# Altium schematic sheet SCH_2-way_Traffic.SchDoc
size A
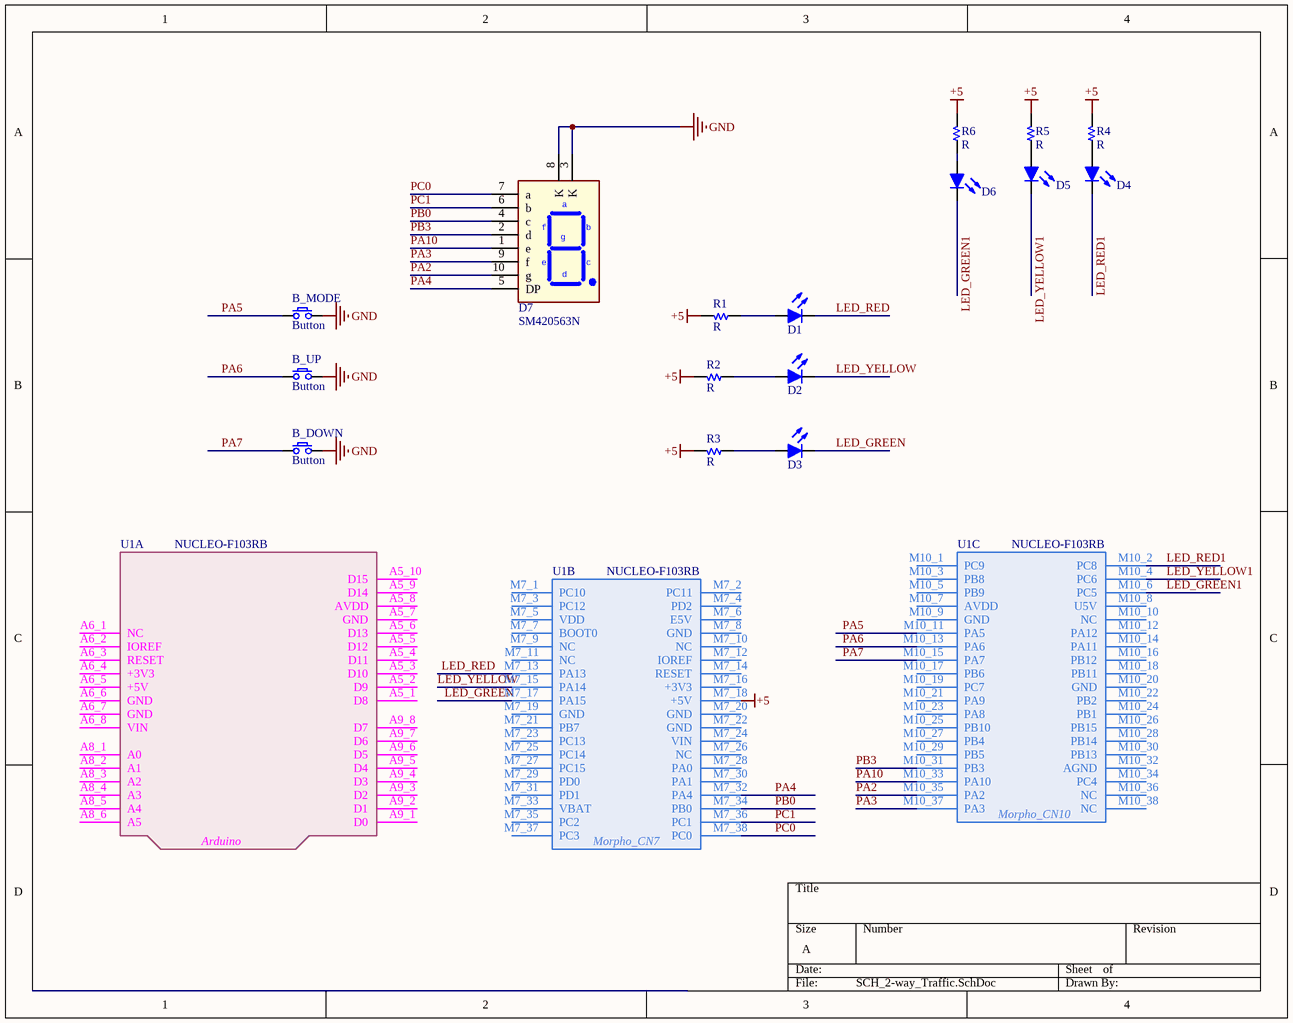
[diagram p0: SCH_2-way_Traffic.SchDoc]

## Parts
B_DOWN  Button  [SW/2/DIP]
B_MODE  Button  [SW/2/DIP]
B_UP  Button  [SW/2/DIP]
D1  Led  [LED 3MM - red]  (value not drawn)
D2  Led  [LED 3MM - yellow]  (value not drawn)
D3  Led  [LED 3MM - green]  (value not drawn)
D4  Led  [LED 3MM - red]  (value not drawn)
D5  Led  [LED 3MM - yellow]  (value not drawn)
D6  Led  [LED 3MM - green]  (value not drawn)
D7  SM420563N  [LED/7SEG/0.56]
R1  R  [R 0805]
R2  R  [R 0805]
R3  R  [R 0805]
R4  R  [R 0805]
R5  R  [R 0805]
R6  R  [R 0805]
U1  NUCLEO-F103RB  [NUCLEO]  (parts A,B,C of 3)

## Nets
+5: R1.2 R2.2 R3.2 R4.2 R5.2 R6.2 U1.M7_18(+5V)
GND: B_DOWN.2 B_MODE.2 B_UP.2 D7.3(K) D7.8(K)
LED_GREEN: D3.2(K) U1.M7_17(PA15)
LED_GREEN1: D6.2(K) U1.M10_6(PC5)
LED_RED: D1.2(K) U1.M7_13(PA13)
LED_RED1: D4.2(K) U1.M10_2(PC8)
LED_YELLOW: D2.2(K) U1.M7_15(PA14)
LED_YELLOW1: D5.2(K) U1.M10_4(PC6)
PA2: D7.10(g) U1.M10_35(PA2)
PA3: D7.9(f) U1.M10_37(PA3)
PA4: D7.5(DP) U1.M7_32(PA4)
PA5: B_MODE.1 U1.M10_11(PA5)
PA6: B_UP.1 U1.M10_13(PA6)
PA7: B_DOWN.1 U1.M10_15(PA7)
PA10: D7.1(e) U1.M10_33(PA10)
PB0: D7.4(c) U1.M7_34(PB0)
PB3: D7.2(d) U1.M10_31(PB3)
PC0: D7.7(a) U1.M7_38(PC0)
PC1: D7.6(b) U1.M7_36(PC1)
NetD1_1: D1.1(A) R1.1
NetD2_1: D2.1(A) R2.1
NetD3_1: D3.1(A) R3.1
NetD4_1: D4.1(A) R4.1
NetD5_1: D5.1(A) R5.1
NetD6_1: D6.1(A) R6.1

Not connected (* = marked no-connect by the designer): U1 A5_1(D8) A5_2(D9) A5_3(D10) A5_4(D11) A5_5(D12) A5_6(D13) A5_7(GND) A5_8(AVDD) A5_9(D14) A5_10(D15) A6_1(NC) A6_2(IOREF) A6_3(RESET) A6_4(+3V3) A6_5(+5V) A6_6(GND) A6_7(GND) A6_8(VIN) A8_1(A0) A8_2(A1) A8_3(A2) A8_4(A3) A8_5(A4) A8_6(A5) A9_1(D0) A9_2(D1) A9_3(D2) A9_4(D3) A9_5(D4) A9_6(D5) A9_7(D6) A9_8(D7) M7_1(PC10) M7_2(PC11) M7_3(PC12) M7_4(PD2) M7_5(VDD) M7_6(E5V) M7_7(BOOT0) M7_8(GND) M7_9(NC) M7_10(NC) M7_11(NC) M7_12(IOREF) M7_14(RESET) M7_16(+3V3) M7_19(GND) M7_20(GND) M7_21(PB7) M7_22(GND) M7_23(PC13) M7_24(VIN) M7_25(PC14) M7_26(NC) M7_27(PC15) M7_28(PA0) M7_29(PD0) M7_30(PA1) M7_31(PD1) M7_33(VBAT) M7_35(PC2) M7_37(PC3) M10_1(PC9) M10_3(PB8) M10_5(PB9) M10_7(AVDD) M10_8(U5V) M10_9(GND) M10_10(NC) M10_12(PA12) M10_14(PA11) M10_16(PB12) M10_17(PB6) M10_18(PB11) M10_19(PC7) M10_20(GND) M10_21(PA9) M10_22(PB2) M10_23(PA8) M10_24(PB1) M10_25(PB10) M10_26(PB15) M10_27(PB4) M10_28(PB14) M10_29(PB5) M10_30(PB13) M10_32(AGND) M10_34(PC4) M10_36(NC) M10_38(NC)

## Notes on the sheet
- (in symbol NUCLEO-F103RB, part A) Arduino
- (in symbol NUCLEO-F103RB, part B) Morpho_CN7
- (in symbol NUCLEO-F103RB, part C) Morpho_CN10

## Library data of the parts
B_DOWN B_MODE B_UP = SW SPST: Tact switch 2 pin
D1-D6 = Led: Typical LED
D7 = LED 7-SEG SM420563N: SM420563N, Common-Cathode, LED 7-seg, RED, 0.56",
R1-R6 = Resistor
U1 = NUCLEO-F103RB: STM32F103RB, mbed-Enabled Development Nucleo-64 STM32F1 ARM® Cortex®-M3 MCU 32-Bit Embedded Evaluation Board; Manufacturer: STMicroelectronics; Manufacturer Product Number: NUCLEO-F103RB; BRAND: STMicroelectronics; PART NO: NUCLEO-F103RB; STOCK CODE: 497-14362-ND; SUPPLIER: digi-key; TYPE: EVAL BRD